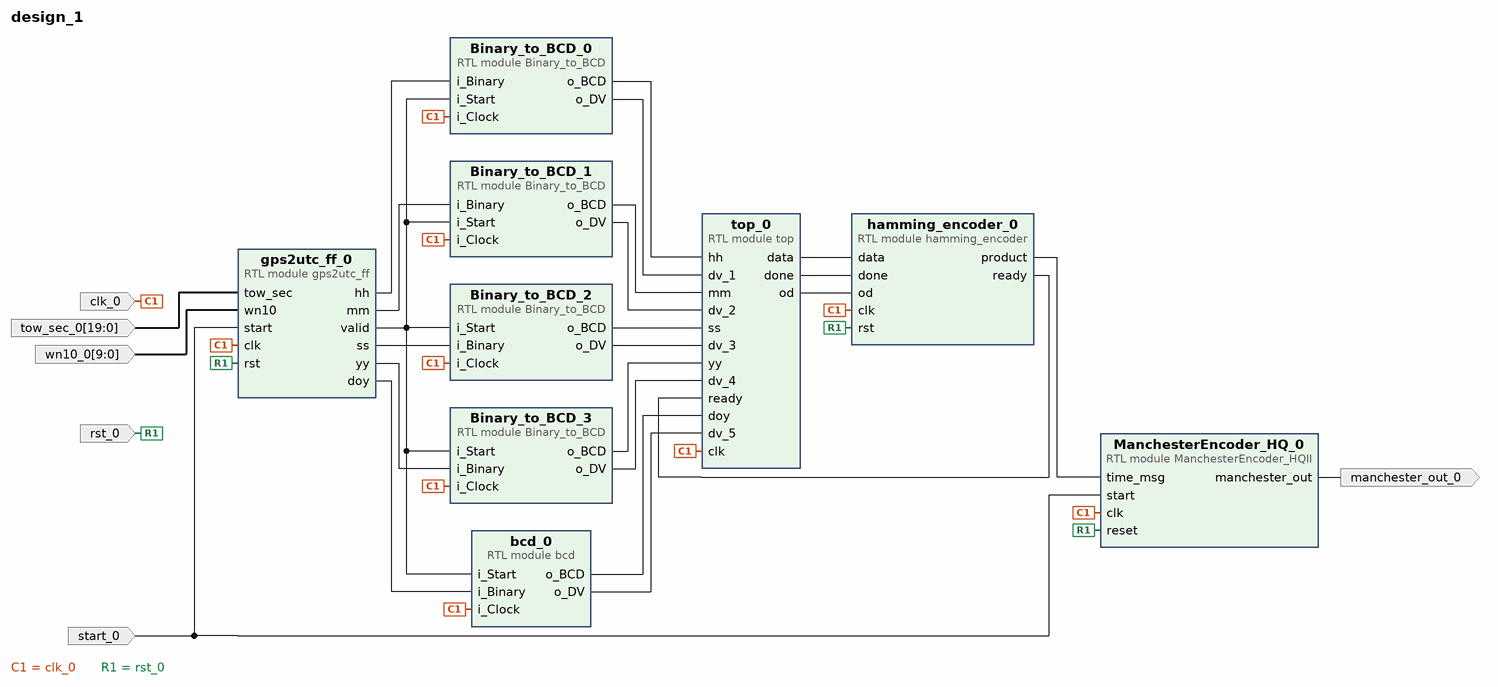
[diagram p0: block diagram of the top level]
# Vivado block design design_1, xcku035-fbva676-1-i, Vivado 2024.2
create_bd_design design_1

create_bd_port -dir I -type clk clk_0
create_bd_port -dir I -type rst rst_0
create_bd_port -dir I start_0
create_bd_port -dir O manchester_out_0
create_bd_port -dir I -from 9 -to 0 wn10_0
create_bd_port -dir I -from 19 -to 0 tow_sec_0

create_bd_cell -type module -reference gps2utc_ff gps2utc_ff_0
create_bd_cell -type module -reference ManchesterEncoder_HQII ManchesterEncoder_HQ_0
create_bd_cell -type module -reference hamming_encoder hamming_encoder_0
create_bd_cell -type module -reference Binary_to_BCD Binary_to_BCD_0
create_bd_cell -type module -reference Binary_to_BCD Binary_to_BCD_1
create_bd_cell -type module -reference Binary_to_BCD Binary_to_BCD_2
create_bd_cell -type module -reference Binary_to_BCD Binary_to_BCD_3
create_bd_cell -type module -reference bcd bcd_0
create_bd_cell -type module -reference top top_0

# ---- connections ----

connect_bd_net [get_bd_pins Binary_to_BCD_0/o_BCD] [get_bd_pins top_0/hh]
connect_bd_net [get_bd_pins Binary_to_BCD_0/o_DV] [get_bd_pins top_0/dv_1]
connect_bd_net [get_bd_pins Binary_to_BCD_1/o_BCD] [get_bd_pins top_0/mm]
connect_bd_net [get_bd_pins Binary_to_BCD_1/o_DV] [get_bd_pins top_0/dv_2]
connect_bd_net [get_bd_pins Binary_to_BCD_2/o_BCD] [get_bd_pins top_0/ss]
connect_bd_net [get_bd_pins Binary_to_BCD_2/o_DV] [get_bd_pins top_0/dv_3]
connect_bd_net [get_bd_pins Binary_to_BCD_3/o_BCD] [get_bd_pins top_0/yy]
connect_bd_net [get_bd_pins Binary_to_BCD_3/o_DV] [get_bd_pins top_0/dv_4]
connect_bd_net [get_bd_pins ManchesterEncoder_HQ_0/manchester_out] [get_bd_ports manchester_out_0]
connect_bd_net [get_bd_pins bcd_0/o_BCD] [get_bd_pins top_0/doy]
connect_bd_net [get_bd_pins bcd_0/o_DV] [get_bd_pins top_0/dv_5]
connect_bd_net -net clk_0_1 [get_bd_ports clk_0] \
  [get_bd_pins gps2utc_ff_0/clk] [get_bd_pins ManchesterEncoder_HQ_0/clk] [get_bd_pins hamming_encoder_0/clk] \
  [get_bd_pins Binary_to_BCD_0/i_Clock] [get_bd_pins Binary_to_BCD_1/i_Clock] [get_bd_pins Binary_to_BCD_2/i_Clock] \
  [get_bd_pins Binary_to_BCD_3/i_Clock] [get_bd_pins bcd_0/i_Clock] [get_bd_pins top_0/clk]
connect_bd_net [get_bd_pins gps2utc_ff_0/doy] [get_bd_pins bcd_0/i_Binary]
connect_bd_net [get_bd_pins gps2utc_ff_0/hh] [get_bd_pins Binary_to_BCD_0/i_Binary]
connect_bd_net [get_bd_pins gps2utc_ff_0/mm] [get_bd_pins Binary_to_BCD_1/i_Binary]
connect_bd_net [get_bd_pins gps2utc_ff_0/ss] [get_bd_pins Binary_to_BCD_2/i_Binary]
connect_bd_net [get_bd_pins gps2utc_ff_0/valid] \
  [get_bd_pins Binary_to_BCD_0/i_Start] [get_bd_pins Binary_to_BCD_1/i_Start] [get_bd_pins Binary_to_BCD_2/i_Start] \
  [get_bd_pins Binary_to_BCD_3/i_Start] [get_bd_pins bcd_0/i_Start]
connect_bd_net [get_bd_pins gps2utc_ff_0/yy] [get_bd_pins Binary_to_BCD_3/i_Binary]
connect_bd_net [get_bd_pins hamming_encoder_0/product] [get_bd_pins ManchesterEncoder_HQ_0/time_msg]
connect_bd_net [get_bd_pins hamming_encoder_0/ready] [get_bd_pins top_0/ready]
connect_bd_net -net rst_0_1 [get_bd_ports rst_0] \
  [get_bd_pins gps2utc_ff_0/rst] [get_bd_pins ManchesterEncoder_HQ_0/reset] [get_bd_pins hamming_encoder_0/rst]
connect_bd_net -net start_0_1 [get_bd_ports start_0] [get_bd_pins gps2utc_ff_0/start] [get_bd_pins ManchesterEncoder_HQ_0/start]
connect_bd_net [get_bd_pins top_0/data] [get_bd_pins hamming_encoder_0/data]
connect_bd_net [get_bd_pins top_0/done] [get_bd_pins hamming_encoder_0/done]
connect_bd_net [get_bd_pins top_0/od] [get_bd_pins hamming_encoder_0/od]
connect_bd_net -net tow_sec_0_1 [get_bd_ports tow_sec_0] [get_bd_pins gps2utc_ff_0/tow_sec]
connect_bd_net -net wn10_0_1 [get_bd_ports wn10_0] [get_bd_pins gps2utc_ff_0/wn10]

validate_bd_design
save_bd_design
